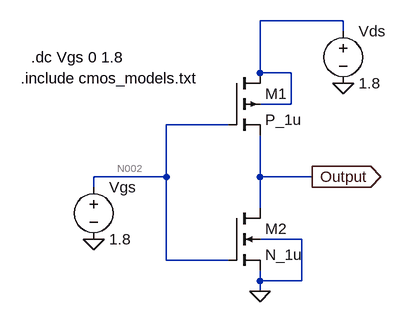
[diagram p0: schematic cmos-inverter-level3.asc]
cmos-inverter-level3.asc, the LTspice schematic file:
Version 4
SHEET 1 1448 4096
WIRE 304 -16 176 -16
WIRE 304 0 304 -16
WIRE 176 64 176 -16
WIRE 224 64 176 64
WIRE 224 112 224 64
WIRE 224 112 176 112
WIRE 128 144 32 144
WIRE 32 224 32 144
WIRE 32 224 -80 224
WIRE 176 224 176 160
WIRE 256 224 176 224
WIRE -80 240 -80 224
WIRE 176 272 176 224
WIRE 240 320 176 320
WIRE 32 352 32 224
WIRE 128 352 32 352
WIRE 176 384 176 368
WIRE 240 384 240 320
WIRE 240 384 176 384
WIRE 176 400 176 384
FLAG 304 80 0
FLAG -80 320 0
FLAG 176 400 0
FLAG 256 224 Output
IOPIN 256 224 Out
SYMBOL voltage 304 -16 R0
WINDOW 123 0 0 Left 0
WINDOW 39 0 0 Left 0
SYMATTR InstName Vds
SYMATTR Value 1.8
SYMBOL voltage -80 224 R0
WINDOW 123 0 0 Left 0
WINDOW 39 0 0 Left 0
SYMATTR InstName Vgs
SYMATTR Value 1.8
SYMBOL pmos4 128 64 R0
SYMATTR InstName M1
SYMATTR Value2 l=50 w=500
SYMATTR Value P_1u
SYMBOL nmos4 128 272 R0
SYMATTR InstName M2
SYMATTR Value2 l=50 w=500
SYMATTR Value N_1u
TEXT -176 40 Left 2 !.dc Vgs 0 1.8
TEXT -192 72 Left 2 !.include cmos_models.txt

The netlist it stands for:
* cmos-inverter-level3.asc
Vds N001 0 1.8
Vgs N002 0 1.8
M1 N001 N002 Output N001 P_1u l=50 w=500
M2 Output N002 0 0 N_1u l=50 w=500
.model NMOS NMOS
.model PMOS PMOS
.lib standard.mos
.dc Vgs 0 1.8
.include cmos_models.txt
.backanno
.end

* Results of the author's LTspice run, read from the files saved beside the schematic
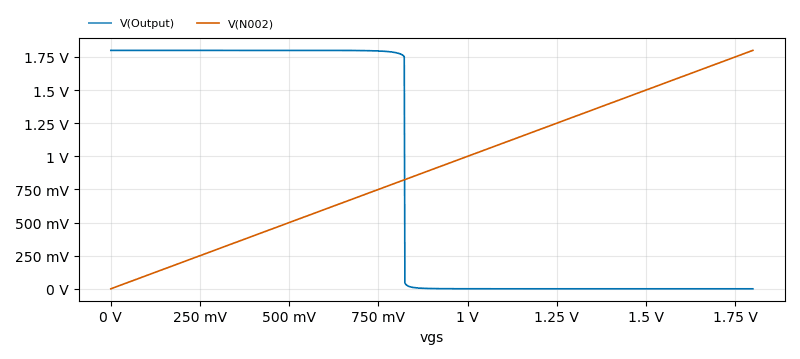
[diagram p1: DC transfer characteristic of cmos-inverter-level3.asc, plotted from the saved traces]
* DC transfer characteristic, 1 run:
*   V(Output): 1.8 V at vgs=0 V, 3.358 nV at vgs=1.8 V, min 3.358 nV, max 1.8 V
*   V(N002): 0 V at vgs=0 V, 1.8 V at vgs=1.8 V, min 0 V, max 1.8 V